# EAGLE design V9958 Video Card V2 (EAGLE 4.16)
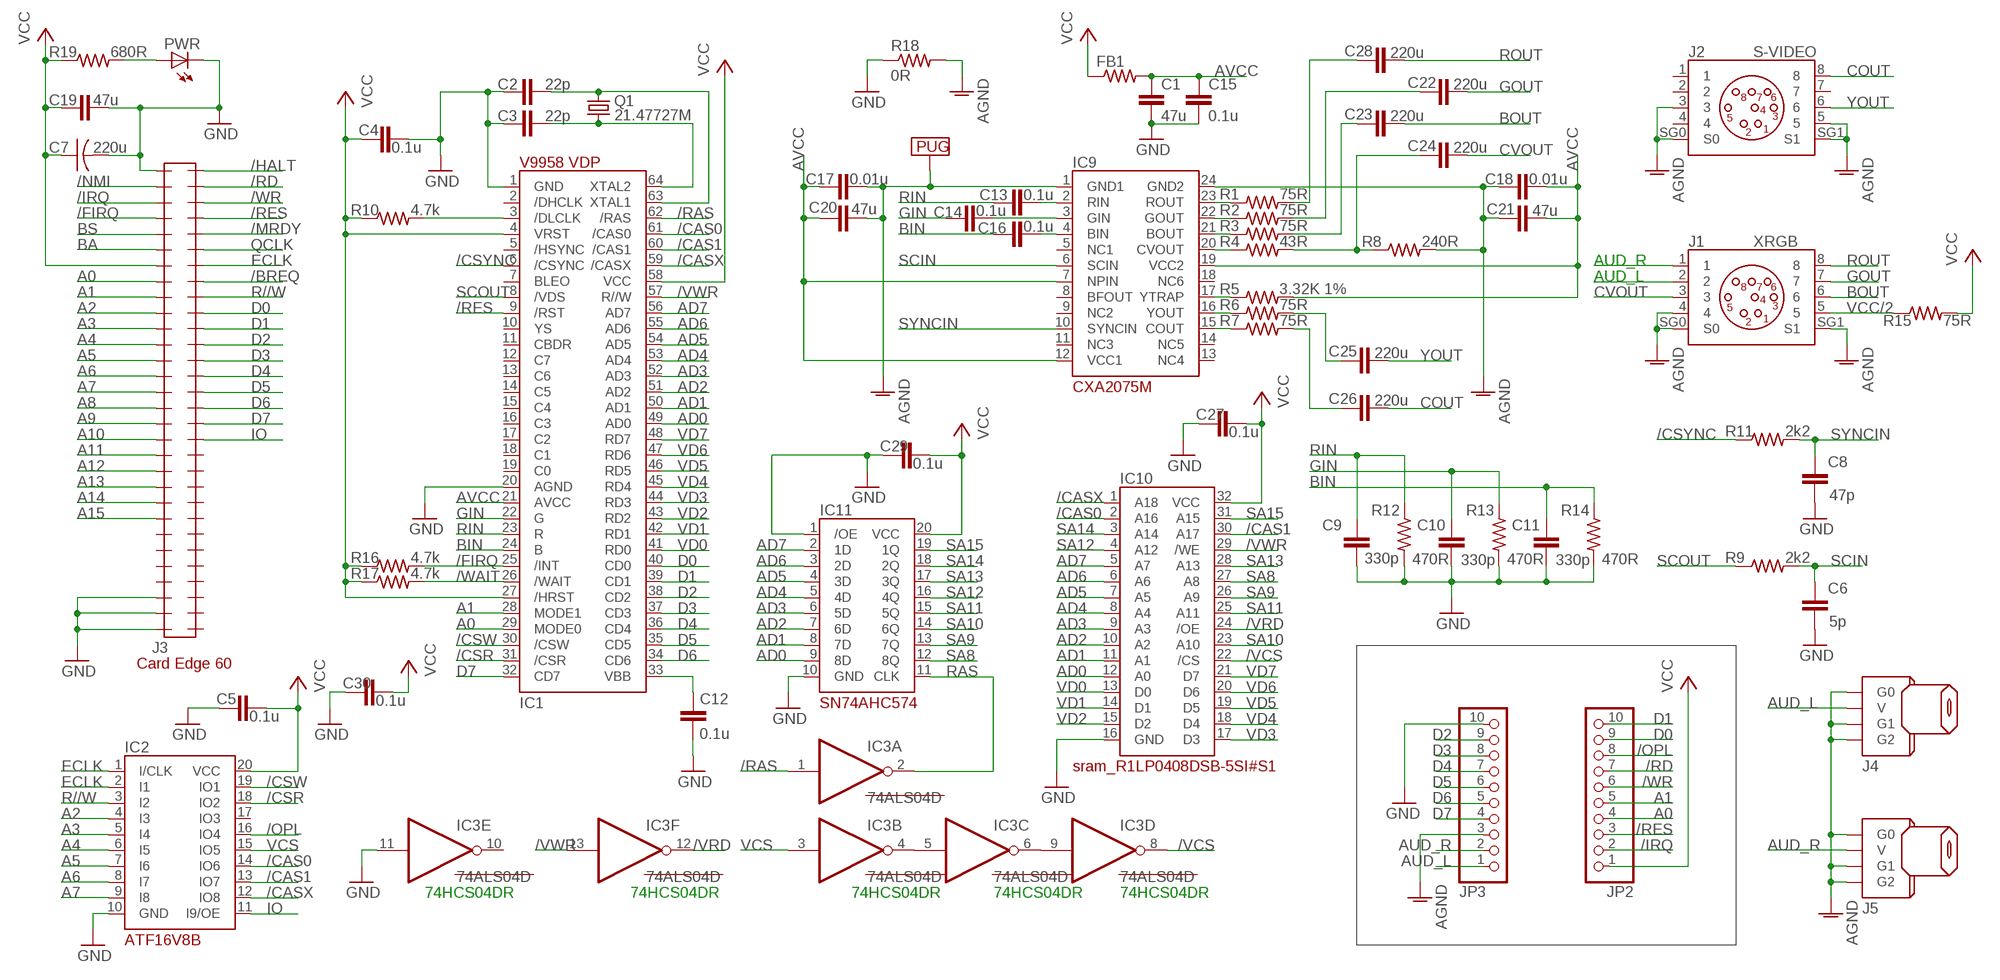
[diagram p0: schematic, sheet 1]

## Parts
C1  47u  C-EUC0805  [C0805]
C2  22p  C-EUC0603  [C0603]
C3  22p  C-EUC0603  [C0603]
C4  0.1u  C-EUC0603  [C0603]
C5  0.1u  C-EUC0603  [C0603]
C6  5p  C-EUC0603  [C0603]
C7  220u  C-US025-050X050  [C025-050X050]
C8  47p  C-EUC0603  [C0603]
C9  330p  C-EUC0603  [C0603]
C10  330p  C-EUC0603  [C0603]
C11  330p  C-EUC0603  [C0603]
C12  0.1u  C-EUC0603  [C0603]
C13  0.1u  C-EUC0603  [C0603]
C14  0.1u  C-EUC0603  [C0603]
C15  0.1u  C-EUC0603  [C0603]
C16  0.1u  C-EUC0603  [C0603]
C17  0.01u  C-EUC0603  [C0603]
C18  0.01u  C-EUC0603  [C0603]
C19  47u  C-EUC0805  [C0805]
C20  47u  C-EUC0805  [C0805]
C21  47u  C-EUC0805  [C0805]
C22  220u  C-EUC1206  [C1206]
C23  220u  C-EUC1206  [C1206]
C24  220u  C-EUC1206  [C1206]
C25  220u  C-EUC1206  [C1206]
C26  220u  C-EUC1206  [C1206]
C27  0.1u  C-EUC0603  [C0603]
C28  220u  C-EUC1206  [C1206]
C29  0.1u  C-EUC0603  [C0603]
C30  0.1u  C-EUC0603  [C0603]
FB1  R-US_R0603  [R0603]
IC1  YAMAHA_V9958  [V9958]
IC2  PLD_ATF16V8B  [DIL20]
IC3  74ALS04D  [SO14]
IC9  CXA2075M  [CXA2075M]
IC10  R1LP0408DSB-5SI#S1  [RENESAS_32-TSOP-II]
IC11  SN74AHC574PWRSO  [SOIC20]
J1  XRGB  MINI-DIN8  [MINI_DIN8]
J2  S-VIDEO  MINI-DIN8  [MINI_DIN8]
J3  CARDEDGE_2.54_60POSEDGE  [CARDEDGE_2.54_60POS]
J4  RCA_CONN_CUI_RCJ-014_CP-1403-ND  [RCA_JACK_CUI_RCJ-014_CP-1403-ND]
J5  RCA_CONN_CUI_RCJ-014_CP-1403-ND  [RCA_JACK_CUI_RCJ-014_CP-1403-ND]
JP2  PINHD-1X10  [1X10]
JP3  PINHD-1X10  [1X10]
PWR  LED3MM  [LED3MM]
Q1  21.47727M  CRYSTALHC49S  [HC49/S]
R1  75R  R-US_R0603  [R0603]
R2  75R  R-US_R0603  [R0603]
R3  75R  R-US_R0603  [R0603]
R4  43R  R-US_R0603  [R0603]
R5  3.32K 1%  R-US_R0603  [R0603]
R6  75R  R-US_R0603  [R0603]
R7  75R  R-US_R0603  [R0603]
R8  240R  R-US_R0603  [R0603]
R9  2k2  R-US_R0603  [R0603]
R10  4.7k  R-US_R0603  [R0603]
R11  2k2  R-US_R0603  [R0603]
R12  470R  R-US_R0603  [R0603]
R13  470R  R-US_R0603  [R0603]
R14  470R  R-US_R0603  [R0603]
R15  75R  R-US_R0603  [R0603]
R16  4.7k  R-US_R0603  [R0603]
R17  4.7k  R-US_R0603  [R0603]
R18  0R  R-US_R0603  [R0603]
R19  680R  R-US_R0603  [R0603]
U$1  PUG  [LARGE_PUG]

## Nets
/BREQ: J3.53
/CAS0: IC1.61(/CAS0) IC2.14(IO6) IC10.2(A16)
/CAS1: IC1.60(/CAS1) IC2.13(IO7) IC10.30(A17)
/CASX: IC1.59(/CASX) IC2.12(IO8) IC10.1(A18)
/CSR: IC1.31(/CSR) IC2.18(IO2)
/CSW: IC1.30(/CSW) IC2.19(IO1)
/CSYNC: IC1.6(/CSYNC) R11.1
/DLCLK: IC1.3(/DLCLK) R10.2
/FIRQ: IC1.25(/INT) J3.4 R16.2
/HALT: J3.60
/IRQ: J3.3 JP2.2
/MRDY: J3.56
/NMI: J3.2
/OPL: IC2.16(IO4) JP2.8
/RAS: IC1.62(/RAS) IC3.1(A:I)
/RD: J3.59 JP2.7
/RES: IC1.9(/RST) J3.57 JP2.3
/VCS: IC3.8(D:O) IC10.22(/CS)
/VRD: IC3.12(F:O) IC10.24(/OE)
/VWR: IC1.57(R//W) IC3.13(F:I) IC10.29(/WE)
/WAIT: IC1.26(/WAIT) R17.2
/WR: J3.58 JP2.6
A0: IC1.29(MODE0) J3.8 JP2.4
A1: IC1.28(MODE1) J3.9 JP2.5
A2: IC2.4(I3) J3.10
A3: IC2.5(I4) J3.11
A4: IC2.6(I5) J3.12
A5: IC2.7(I6) J3.13
A6: IC2.8(I7) J3.14
A7: IC2.9(I8) J3.15
A8: J3.16
A9: J3.17
A10: J3.18
A11: J3.19
A12: J3.20
A13: J3.21
A14: J3.22
A15: J3.23
AD0: IC1.49(AD0) IC10.12(A0) IC11.9(8D)
AD1: IC1.50(AD1) IC10.11(A1) IC11.8(7D)
AD2: IC1.51(AD2) IC10.10(A2) IC11.7(6D)
AD3: IC1.52(AD3) IC10.9(A3) IC11.6(5D)
AD4: IC1.53(AD4) IC10.8(A4) IC11.5(4D)
AD5: IC1.54(AD5) IC10.7(A5) IC11.4(3D)
AD6: IC1.55(AD6) IC10.6(A6) IC11.3(2D)
AD7: IC1.56(AD7) IC10.5(A7) IC11.2(1D)
AGND [agnd]: C17.2 C18.1 C20.2 C21.1 IC9.1(GND1) IC9.24(GND2) J1.4 J1.SG0(S0) J1.SG1(S1) J2.3 J2.5 J2.SG0(S0) J2.SG1(S1) J4.G0 J4.G1 J4.G2 J5.G0 J5.G1 J5.G2 JP3.3 R8.2 R18.2 U$1.P$1
AUD_L: J1.2 J4.V JP3.1
AUD_R: J1.1 J5.V JP3.2
AVCC [supply]: C1.1 C15.1 C17.1 C18.2 C20.1 C21.2 FB1.2 IC1.21(AVCC) IC9.7(NPIN) IC9.12(VCC1) IC9.19(VCC2) R5.2
BA: J3.6
BIN: C11.1 C16.1 IC1.24(B) R14.1
BOUT: C23.2 J1.6
BS: J3.5
COUT: C26.2 J2.8
CVOUT: C24.2 J1.3
D0: IC1.40(CD0) J3.51 JP2.9
D1: IC1.39(CD1) J3.50 JP2.10
D2: IC1.38(CD2) J3.49 JP3.9
D3: IC1.37(CD3) J3.48 JP3.8
D4: IC1.36(CD4) J3.47 JP3.7
D5: IC1.35(CD5) J3.46 JP3.6
D6: IC1.34(CD6) J3.45 JP3.5
D7: IC1.32(CD7) J3.44 JP3.4
ECLK: IC2.1(I/CLK) IC2.2(I1) J3.54
GIN: C10.1 C14.1 IC1.22(G) R13.1
GND: C1.2 C2.1 C3.1 C4.2 C5.1 C6.2 C7.2 C8.2 C9.2 C10.2 C11.2 C12.2 C15.2 C19.2 C27.1 C29.1 C30.1 IC1.1(GND) IC1.20(AGND) IC2.10(GND) IC3.11(E:I) IC10.16(GND) IC11.1(/OE) IC11.10(GND) J3.1 J3.28 J3.29 J3.30 JP3.10 PWR.K(C) R12.2 R13.2 R14.2 R18.1
GOUT: C22.2 J1.7
IO: IC2.11(I9/OE) J3.43
N$1: C2.2 IC1.63(XTAL1) Q1.2
N$2: C3.2 IC1.64(XTAL2) Q1.1
N$4: C13.2 IC9.2(RIN)
N$5: C14.2 IC9.3(GIN)
N$6: C16.2 IC9.4(BIN)
N$7: C26.1 R7.2
N$8: IC9.17(YTRAP) R5.1
N$9: IC9.23(ROUT) R1.1
N$10: IC9.22(GOUT) R2.1
N$11: IC9.21(BOUT) R3.1
N$12: IC9.20(CVOUT) R4.1
N$13: IC9.16(YOUT) R6.1
N$14: IC9.15(COUT) R7.1
N$15: C24.1 R4.2 R8.1
N$16: C25.1 R6.2
N$17: C23.1 R3.2
N$18: C22.1 R2.2
N$19: C28.1 R1.2
N$20: C12.1 IC1.33(VBB)
N$21: IC3.4(B:O) IC3.5(C:I)
N$22: IC3.6(C:O) IC3.9(D:I)
N$23: PWR.A R19.2
QCLK: J3.55
R//W: IC2.3(I2) J3.52
RAS: IC3.2(A:O) IC11.11(CLK)
RIN: C9.1 C13.1 IC1.23(R) R12.1
ROUT: C28.2 J1.8
SA8: IC10.27(A8) IC11.12(8Q)
SA9: IC10.26(A9) IC11.13(7Q)
SA10: IC10.23(A10) IC11.14(6Q)
SA11: IC10.25(A11) IC11.15(5Q)
SA12: IC10.4(A12) IC11.16(4Q)
SA13: IC10.28(A13) IC11.17(3Q)
SA14: IC10.3(A14) IC11.18(2Q)
SA15: IC10.31(A15) IC11.19(1Q)
SCIN: C6.1 IC9.6(SCIN) R9.2
SCOUT: IC1.8(/VDS) R9.1
SYNCIN: C8.1 IC9.10(SYNCIN) R11.2
VCC [supply]: C4.1 C5.2 C7.1 C19.1 C27.2 C29.2 C30.2 FB1.1 IC1.4(VRST) IC1.27(/HRST) IC1.58(VCC) IC2.20(VCC) IC10.32(VCC) IC11.20(VCC) J3.7 JP2.1 R10.1 R15.2 R16.1 R17.1 R19.1
VCC/2: J1.5 R15.1
VCS: IC2.15(IO5) IC3.3(B:I)
VD0: IC1.41(RD0) IC10.13(D0)
VD1: IC1.42(RD1) IC10.14(D1)
VD2: IC1.43(RD2) IC10.15(D2)
VD3: IC1.44(RD3) IC10.17(D3)
VD4: IC1.45(RD4) IC10.18(D4)
VD5: IC1.46(RD5) IC10.19(D5)
VD6: IC1.47(RD6) IC10.20(D6)
VD7: IC1.48(RD7) IC10.21(D7)
YOUT: C25.2 J2.6
Unconnected: IC1.2(/DHCLK) IC1.5(/HSYNC) IC1.7(BLEO) IC1.10(YS) IC1.11(CBDR) IC1.12(C7) IC1.13(C6) IC1.14(C5) IC1.15(C4) IC1.16(C3) IC1.17(C2) IC1.18(C1) IC1.19(C0) IC2.17(IO3) IC3.10(E:O) IC9.5(NC1) IC9.8(BFOUT) IC9.9(NC2) IC9.11(NC3) IC9.13(NC4) IC9.14(NC5) IC9.18(NC6) J2.1 J2.2 J2.4 J2.7 J3.24 J3.25 J3.26 J3.27 J3.31 J3.32 J3.33 J3.34 J3.35 J3.36 J3.37 J3.38 J3.39 J3.40 J3.41 J3.42

## Notes on the sheet
- AUD_R
- AUD_L
- 74HCS04DR | 74HCS04DR | 74HCS04DR | 74HCS04DR | 74HCS04DR

## Power pins joined to a net without a drawn wire
GND: IC3.7(P:GND)
VCC: IC3.14(P:VCC)

## Library data of the parts
C1-C6 C8-C30 = rcl:C-EU: CAPACITOR, European symbol
C7 = rcl:C-US: CAPACITOR, American symbol
FB1 R1-R19 = rcl:R-US_: RESISTOR, American symbol
IC1 = 07-Retrocomputing:YAMAHA_V9958
IC2 = 07-Retrocomputing:PLD_ATF16V8B
IC3 = 74xx-us:74*04: Hex INVERTER
IC9 = 07-Retrocomputing:CXA2075M
IC10 = 07-Retrocomputing:R1LP0408DSB-5SI#S1
IC11 = 07-Retrocomputing:SN74AHC574PWR
J1 J2 = 07-Retrocomputing:MINI-DIN8
J3 = 07-Retrocomputing:CARDEDGE_2.54_60POS
J4 J5 = 07-Retrocomputing:RCA_CONN_CUI_RCJ-014_CP-1403-ND
JP2 JP3 = pinhead:PINHD-1X10: PIN HEADER
PWR = led:LED: LED OSRAM: - CHIPLED LG R971, LG N971, LY N971, LG Q971, LY Q971, LO R971, LY R971 LH N974, LH R974 LS Q976, LO Q976, LY Q976 LO Q996 - Hyper CHIPLED LW Q18S LB Q993, LB Q99A, LB R99A - SideLED LS A670, LO A670, LY A670, LG A670, LP A670 LB A673, LV A673, LT A673, LW A673 LH A674 LY A675 LS A676, LA A676, LO A676, LY A676, LW A676 LS A679, LY A679, LG A679 - Hyper Micro SIDELED® LS Y876, LA Y876, LO Y876, LY Y876 LT Y87S - SmartLED LW L88C, LW L88S LB L89C, LB L89S, LG L890 LS L89K, LO L89K, LY L89K LS L896, LA L896, LO L896, LY L896 - TOPLED LS T670, LO T670, LY T670, LG T670, LP T670 LSG T670, LSP T670, LSY T670, LOP T670, LYG T670 LG T671, LOG T671, LSG T671 LB T673, LV T673, LT T673, LW T673 LH T674 LS T676, LA T676, LO T676, LY T676, LB T676, LH T676, LSB T676, LW T676 LB T67C, LV T67C, LT T67C, LS T67K, LO T67K, LY T67K, LW E67C LS E67B, LA E67B, LO E67B, LY E67B, LB E67C, LV E67C, LT E67C LW T67C LS T679, LY T679, LG T679 LS T770, LO T770, LY T770, LG T770, LP T770 LB T773, LV T773, LT T773, LW T773 LH T774 LS E675, LA E675, LY E675, LS T675 LS T776, LA T776, LO T776, LY T776, LB T776 LHGB T686 LT T68C, LB T68C - Hyper Mini TOPLED® LB M676 - Mini TOPLED Santana® LG M470 LS M47K, LO M47K, LY M47K Source: http://www.osram.convergy.de - LUMILED® LXK2-PW12-R00, LXK2-PW12-S00, LXK2-PW14-U00, LXK2-PW14-V00 LXK2-PM12-R00, LXK2-PM12-S00, LXK2-PM14-U00 LXK2-PE12-Q00, LXK2-PE12-R00, LXK2-PE12-S00, LXK2-PE14-T00, LXK2-PE14-U00 LXK2-PB12-K00, LXK2-PB12-L00, LXK2-PB12-M00, LXK2-PB14-N00, LXK2-PB14-P00, LXK2-PB14-Q00 LXK2-PR12-L00, LXK2-PR12-M00, LXK2-PR14-Q00, LXK2-PR14-R00 LXK2-PD12-Q00, LXK2-PD12-R00, LXK2-PD12-S00 LXK2-PH12-R00, LXK2-PH12-S00 LXK2-PL12-P00, LXK2-PL12-Q00, LXK2-PL12-R00 Source: www.luxeon.com
Q1 = crystal:CRYSTAL: CRYSTAL
U$1 = 07-Retrocomputing:PUG

## Net classes
0 default: width 0.203 mm, drill 0.203 mm, clearance 0.254 mm
1 supply: width 0.61 mm, drill 0.203 mm, clearance 0.305 mm
2 agnd: width 0.406 mm, drill 0.203 mm, clearance 0.305 mm

## Board
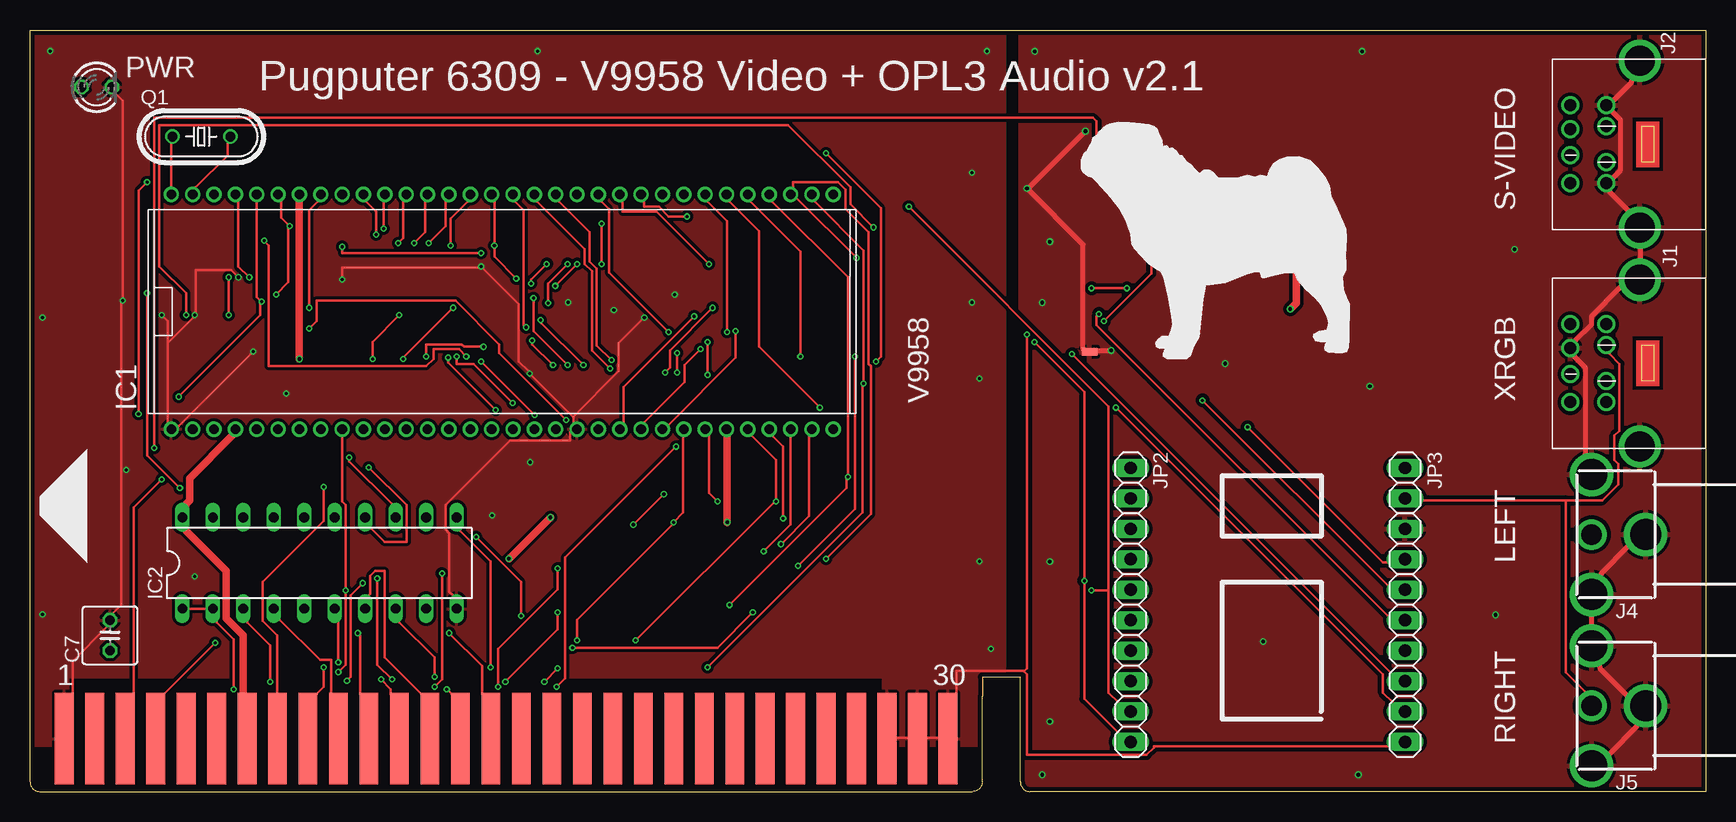
[diagram p1: board, top side]
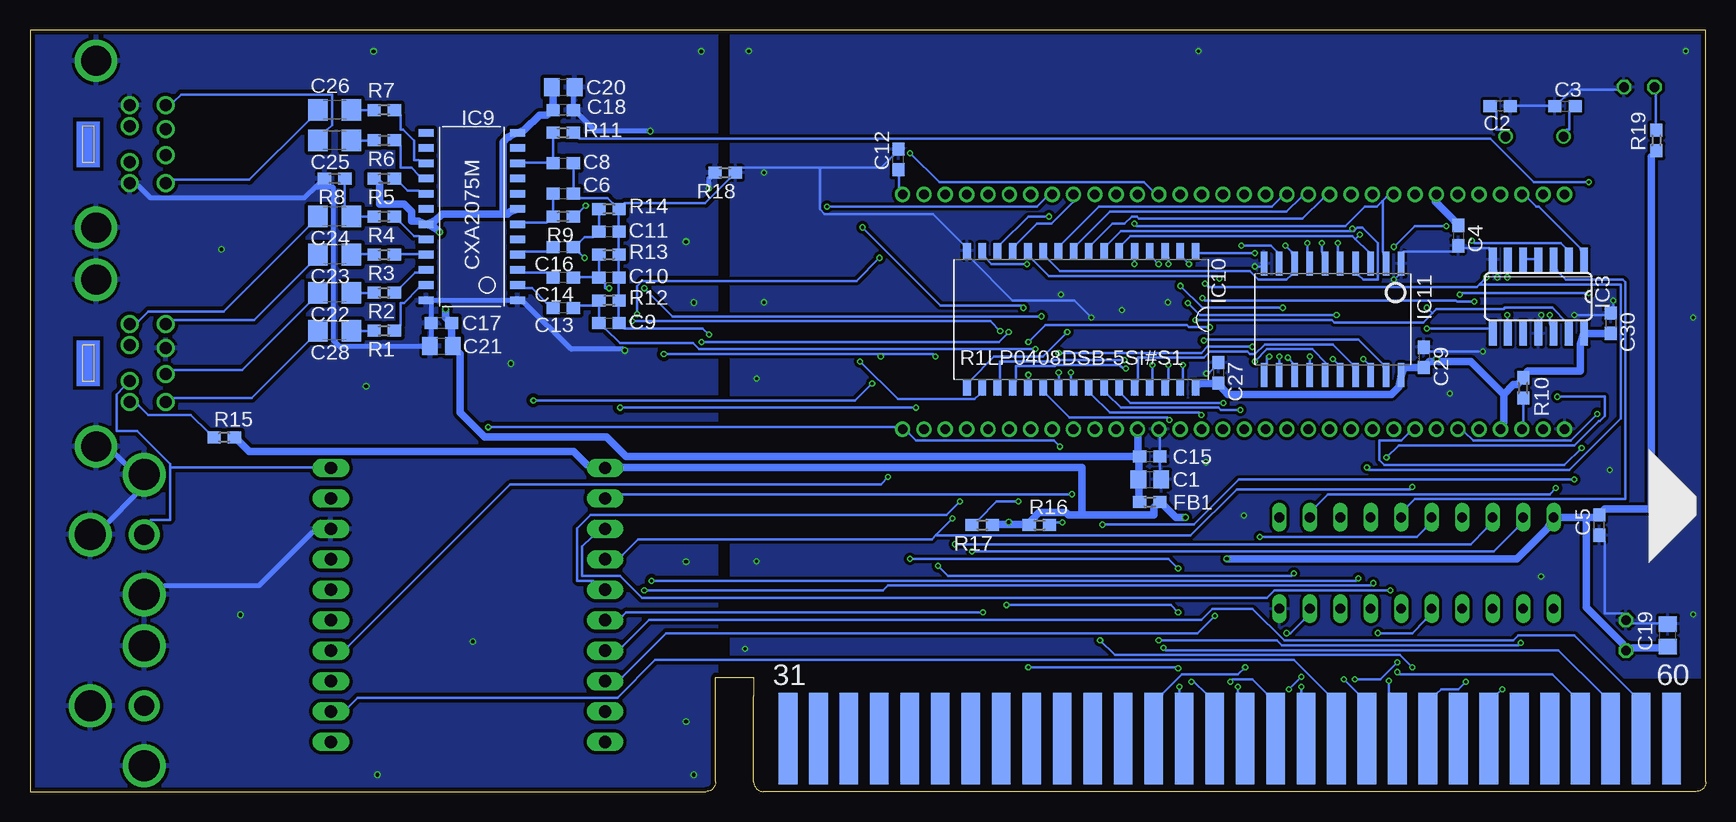
[diagram p2: board, bottom side, seen from below]

Size 139.7 x 63.5 mm. Coordinates in mm from the lower left corner, seen from the top.
Outline: 0,7.94 0,63.5 139.7,63.5 139.7,0 83.34,0 arc-90 82.55,0.79 82.55,9.53 79.38,9.53 79.38,7.94
Copper layers (1*16): Top 0.0356mm / dielectric 1.6mm / Bottom 0.0356mm
Design rules "oshpark-2layer": minimum track width 6mil, minimum drill 10mil, track to track 6mil, track to pad 6mil, pad to pad 6mil, via to via 6mil, smd to smd 6mil, copper to edge 15mil, drill to drill 6mil, minimum pad ring 5mil, minimum via ring 5mil, stop-mask expansion 2.5mil, vias tented up to drill 0mil, thermal gap 10mil

### Footprints (pad centres in the part's own frame; a part is rotated, then mirrored left to right if it is on the bottom)
C0805 = smd 1.3 x 1.5: 1 -0.95,0; 2 0.95,0
C0603 = smd 1.1 x 1: 1 -0.85,0; 2 0.85,0
C025-050X050 = drill 0.813 octagon: 1 -1.27,0; 2 1.27,0
C1206 = smd 1.6 x 1.8: 1 -1.4,0; 2 1.4,0
R0603 = smd 1.1 x 1: 1 -0.85,0; 2 0.85,0
V9958 = drill 0.8 pad 1.27 round: 1 -27.59,-9.79; 2 -25.81,-9.79; 3 -24.03,-9.79; 4 -22.25,-9.79; 5 -20.47,-9.79; 6 -18.69,-9.79; 7 -16.91,-9.79; 8 -15.13,-9.79; 9 -13.35,-9.79; 10 -11.57,-9.79; 11 -9.79,-9.79; 12 -8.01,-9.79; 13 -6.23,-9.79; 14 -4.45,-9.79; 15 -2.67,-9.79; 16 -0.89,-9.79; 17 0.89,-9.79; 18 2.67,-9.79; 19 4.45,-9.79; 20 6.23,-9.79; 21 8.01,-9.79; 22 9.79,-9.79; 23 11.57,-9.79; 24 13.35,-9.79; 25 15.13,-9.79; 26 16.91,-9.79; 27 18.69,-9.79; 28 20.47,-9.79; 29 22.25,-9.79; 30 24.03,-9.79; 31 25.81,-9.79; 32 27.59,-9.79; 33 27.59,9.79; 34 25.81,9.79; 35 24.03,9.79; 36 22.25,9.79; 37 20.47,9.79; 38 18.69,9.79; 39 16.91,9.79; 40 15.13,9.79; 41 13.35,9.79; 42 11.57,9.79; 43 9.79,9.79; 44 8.01,9.79; 45 6.23,9.79; 46 4.45,9.79; 47 2.67,9.79; 48 0.89,9.79; 49 -0.89,9.79; 50 -2.67,9.79; 51 -4.45,9.79; 52 -6.23,9.79; 53 -8.01,9.79; 54 -9.79,9.79; 55 -11.57,9.79; 56 -13.35,9.79; 57 -15.13,9.79; 58 -16.91,9.79; 59 -18.69,9.79; 60 -20.47,9.79; 61 -22.25,9.79; 62 -24.03,9.79; 63 -25.81,9.79; 64 -27.59,9.79
DIL20 = drill 0.813 long: 1 -11.43,-3.81; 2 -8.89,-3.81; 3 -6.35,-3.81; 4 -3.81,-3.81; 5 -1.27,-3.81; 6 1.27,-3.81; 7 3.81,-3.81; 8 6.35,-3.81; 9 8.89,-3.81; 10 11.43,-3.81; 11 11.43,3.81; 12 8.89,3.81; 13 6.35,3.81; 14 3.81,3.81; 15 1.27,3.81; 16 -1.27,3.81; 17 -3.81,3.81; 18 -6.35,3.81; 19 -8.89,3.81; 20 -11.43,3.81
SO14 = smd 0.66 x 2.032: 1 -3.81,-3.073; 2 -2.54,-3.073; 3 -1.27,-3.073; 4 0,-3.073; 5 1.27,-3.073; 6 2.54,-3.073; 7 3.81,-3.073; 8 3.81,3.073; 9 2.54,3.073; 10 1.27,3.073; 11 0,3.073; 12 -1.27,3.073; 13 -2.54,3.073; 14 -3.81,3.073
CXA2075M = smd 1.27 x 0.635: 1 -3.81,6.985; 2 -3.81,5.715; 3 -3.81,4.445; 4 -3.81,3.175; 5 -3.81,1.905; 6 -3.81,0.635; 7 -3.81,-0.635; 8 -3.81,-1.905; 9 -3.81,-3.175; 10 -3.81,-4.445; 11 -3.81,-5.715; 12 -3.81,-6.985; 13 3.81,-6.985; 14 3.81,-5.715; 15 3.81,-4.445; 16 3.81,-3.175; 17 3.81,-1.905; 18 3.81,-0.635; 19 3.81,0.635; 20 3.81,1.905; 21 3.81,3.175; 22 3.81,4.445; 23 3.81,5.715; 24 3.81,6.985
RENESAS_32-TSOP-II = smd 1.27 x 0.635: 1 -5.715,9.525; 2 -5.715,8.255; 3 -5.715,6.985; 4 -5.715,5.715; 5 -5.715,4.445; 6 -5.715,3.175; 7 -5.715,1.905; 8 -5.715,0.635; 9 -5.715,-0.635; 10 -5.715,-1.905; 11 -5.715,-3.175; 12 -5.715,-4.445; 13 -5.715,-5.715; 14 -5.715,-6.985; 15 -5.715,-8.255; 16 -5.715,-9.525; 17 5.715,-9.525; 18 5.715,-8.255; 19 5.715,-6.985; 20 5.715,-5.715; 21 5.715,-4.445; 22 5.715,-3.175; 23 5.715,-1.905; 24 5.715,-0.635; 25 5.715,0.635; 26 5.715,1.905; 27 5.715,3.175; 28 5.715,4.445; 29 5.715,5.715; 30 5.715,6.985; 31 5.715,8.255; 32 5.715,9.525
SOIC20 = smd 2 x 0.55: 1 -4.645,5.715; 2 -4.645,4.445; 3 -4.645,3.175; 4 -4.645,1.905; 5 -4.645,0.635; 6 -4.645,-0.635; 7 -4.645,-1.905; 8 -4.645,-3.175; 9 -4.645,-4.445; 10 -4.645,-5.715; 11 4.645,-5.715; 12 4.645,-4.445; 13 4.645,-3.175; 14 4.645,-1.905; 15 4.645,-0.635; 16 4.645,0.635; 17 4.645,1.905; 18 4.645,3.175; 19 4.645,4.445; 20 4.645,5.715
MINI_DIN8 = drill 1 round: 1 1.5,8.3; 2 -1.5,8.3; 3 3.25,8.3; 4 1.25,11.3; 5 -3.25,8.3; 6 3.25,11.3; 7 -0.9,11.3; 8 -3.25,11.3 | drill 2.5 round: SG0 -6.95,5.5; SG1 6.95,5.5
CARDEDGE_2.54_60POS = smd 1.556 x 7.62: 1 -36.83,4.41; 2 -34.29,4.41; 3 -31.75,4.41; 4 -29.21,4.41; 5 -26.67,4.41; 6 -24.13,4.41; 7 -21.59,4.41; 8 -19.05,4.41; 9 -16.51,4.41; 10 -13.97,4.41; 11 -11.43,4.41; 12 -8.89,4.41; 13 -6.35,4.41; 14 -3.81,4.41; 15 -1.27,4.41; 16 1.27,4.41; 17 3.81,4.41; 18 6.35,4.41; 19 8.89,4.41; 20 11.43,4.41; 21 13.97,4.41; 22 16.51,4.41; 23 19.05,4.41; 24 21.59,4.41; 25 24.13,4.41; 26 26.67,4.41; 27 29.21,4.41; 28 31.75,4.41; 29 34.29,4.41; 30 36.83,4.41 | smd 1.556 x 7.62 bottom: 31 36.83,4.41; 32 34.29,4.41; 33 31.75,4.41; 34 29.21,4.41; 35 26.67,4.41; 36 24.13,4.41; 37 21.59,4.41; 38 19.05,4.41; 39 16.51,4.41; 40 13.97,4.41; 41 11.43,4.41; 42 8.89,4.41; 43 6.35,4.41; 44 3.81,4.41; 45 1.27,4.41; 46 -1.27,4.41; 47 -3.81,4.41; 48 -6.35,4.41; 49 -8.89,4.41; 50 -11.43,4.41; 51 -13.97,4.41; 52 -16.51,4.41; 53 -19.05,4.41; 54 -21.59,4.41; 55 -24.13,4.41; 56 -26.67,4.41; 57 -29.21,4.41; 58 -31.75,4.41; 59 -34.29,4.41; 60 -36.83,4.41
RCA_JACK_CUI_RCJ-014_CP-1403-ND = drill 2.6 round: G0 -5,0; G1 0,4.5; G2 5,0 | drill 1.7 round: V 0,0
1X10 = drill 1.016 long: 1 -11.43,0; 2 -8.89,0; 3 -6.35,0; 4 -3.81,0; 5 -1.27,0; 6 1.27,0; 7 3.81,0; 8 6.35,0; 9 8.89,0; 10 11.43,0
LED3MM = drill 0.813 octagon: A -1.27,0; K 1.27,0
HC49/S = drill 0.813 round: 1 -2.413,0; 2 2.413,0
LARGE_PUG = smd 1.27 x 0.635: P$1 2.286,3.962

### Placement (x,y rotation side)
C1  46.35,26.04 0 bottom
C2  17.14,57.15 180 bottom
C3  11.75,57.15 0 bottom
C4  20.64,46.36 270 bottom
C5  8.89,22.23 90 bottom
C6  95.25,49.85 0 bottom
C7  6.67,13.02 90 top
C8  95.25,52.39 0 bottom
C9  91.44,39.05 0 bottom
C10  91.44,42.86 0 bottom
C11  91.44,46.67 0 bottom
C12  67.31,52.7 90 bottom
C13  95.25,40.32 180 bottom
C14  95.25,42.86 180 bottom
C15  46.35,27.94 0 bottom
C16  95.25,45.4 180 bottom
C17  105.41,39.05 180 bottom
C18  95.25,56.83 180 bottom
C19  3.17,13.02 90 bottom
C20  95.25,58.74 0 bottom
C21  105.41,37.15 0 bottom
C22  114.3,41.59 180 bottom
C23  114.3,44.77 180 bottom
C24  114.3,47.94 180 bottom
C25  114.3,54.29 180 bottom
C26  114.3,56.83 180 bottom
C27  40.64,34.92 270 bottom
C28  114.3,38.42 180 bottom
C29  23.5,36.2 270 bottom
C30  7.94,39.05 270 bottom
FB1  46.35,24.13 180 bottom
IC1  39.37,40.01 0 top
IC2  24.13,19.05 0 top
IC3  13.97,41.27 180 bottom
IC9  102.87,47.94 180 bottom
IC10  52.07,39.37 270 bottom
IC11  31.11,39.37 270 bottom
J1  139.7,35.72 90 top
J2  139.7,53.98 90 top
J3  39.69,0 0 top
J4  130.18,21.43 270 top
J5  130.18,7.14 270 top
JP2  91.76,15.56 270 top
JP3  114.62,15.56 270 top
PWR  5.56,58.74 0 top
Q1  14.29,54.61 0 top
R1  110.17,38.42 180 bottom
R2  110.17,41.59 180 bottom
R3  110.17,44.77 180 bottom
R4  110.17,47.94 180 bottom
R5  110.17,51.12 180 bottom
R6  110.17,54.29 180 bottom
R7  110.17,56.83 180 bottom
R8  114.3,51.12 180 bottom
R9  95.25,47.94 180 bottom
R10  15.24,33.66 270 bottom
R11  95.25,54.93 180 bottom
R12  91.44,40.96 0 bottom
R13  91.44,44.77 0 bottom
R14  91.44,48.58 0 bottom
R15  123.51,29.53 0 bottom
R16  55.56,22.23 0 bottom
R17  60.33,22.23 180 bottom
R18  81.76,51.59 180 bottom
R19  4.13,54.29 90 bottom
U$1  86.04,32.7 0 top

### Tracks (layer width: path | path; a pad name or v marks a point on that pad's centre or on a via)
/CAS0  (via drill 0.25)
  Top 0.203: v43.08,43.99 41.76,42.67 v41.76,42.37 | v18.29,42.88 17.37,43.79 17.37,49.17 IC1.61 | v28.25,27.03 31.39,23.88 31.39,20.83 29.57,20.83 28.45,21.95 IC2.14
  Bottom 0.203: v43.08,43.99 43.59,44.5 IC10.2 | v41.76,42.37 41.45,42.06 19.1,42.06 18.85,42.32 | 18.85,42.32 v18.29,42.88 | v28.25,27.03 28.04,26.82 11.38,26.82 7.11,31.09 7.11,42.27 18.8,42.27 18.85,42.32
/CAS1  (via drill 0.25)
  Top 0.203: v44.81,35.56 41.96,38.41 v41.96,41.15 | IC1.60 18.9,49.17 18.9,41.25 v19.3,40.84 19.2,40.64 19.2,39.73 v12.39,32.92 | v26.62,27.84 26.62,27.53 30.18,23.98 IC2.13
  Bottom 0.203: v44.81,35.56 44.81,34.24 IC10.30 | v41.96,41.15 41.76,40.95 20.83,40.95 20.73,40.84 v19.3,40.84 | v26.62,27.84 25.6,28.85 10.97,28.85 8.94,30.89 8.84,30.89 8.43,31.29 8.43,32.92 v12.39,32.92
/CASX  (via drill 0.25)
  Top 0.203: v37.59,44.91 26.01,44.91 v26.01,45.41 | IC1.59 20.93,49.17 20.93,47.85 v21.64,47.14 21.54,46.94 21.54,42.47 v20.52,41.45 | v12.5,25.3 9.75,28.04 v9.75,41.55
  Bottom 0.203: v37.59,44.91 42.27,44.91 IC10.1 | v26.01,45.41 24.28,47.14 v21.64,47.14 | v12.5,25.3 13.01,24.79 31.5,24.79 32.51,23.77 IC2.12 | v9.75,41.55 20.42,41.55 v20.52,41.45
/CSR  (via drill 0.25)
  Top 0.203: v62.59,20.62 64.92,22.96 64.92,29.67 IC1.31
  Bottom 0.203: v62.59,20.62 19.61,20.62 18.29,21.95 IC2.18
/CSW  (via drill 0.25)
  Top 0.203: v61.16,20.02 63.4,22.25 63.4,29.67 IC1.30
  Bottom 0.203: v61.16,20.02 17.68,20.02 15.75,21.95 IC2.19
/CSYNC  (via drill 0.25)
  Top 0.203: v9.75,50.8 9.04,50.09 v9.04,31.5
  Bottom 0.203: v9.75,50.8 14.33,50.8 17.98,54.46 93.88,54.46 R11.1 | v9.04,31.5 11.28,29.26 19.41,29.26 20.12,29.97 IC1.6
/DLCLK
  Bottom 0.203: R10.2 15.24,30.79 IC1.3
/FIRQ  (via drill 0.25)
  Top 0.203: IC1.25 54.46,29.67 54.46,23.27 v53.65,22.45 53.54,22.25 45.62,14.33 v45.62,12.6 | v15.44,12.39 11.18,8.13 J3.4
  Bottom 0.203: v53.65,22.45 54.25,22.45 R16.2 | v45.62,12.6 35.76,12.6 35.36,12.19 15.65,12.19 v15.44,12.39
/IRQ  (via drill 0.25)
  Top 0.203: v50.29,22.25 v52.83,24.79 | v10.97,26.01 8.64,23.67 8.64,8.13 J3.3
  Bottom 0.203: v52.83,24.79 90.32,24.79 JP2.2 | v50.29,22.25 42.67,22.25 38.91,26.01 v10.97,26.01
/OPL  (via drill 0.25)
  Top 0.203: v37.19,21.23 40.95,17.48 v40.95,14.63
  Bottom 0.203: v37.19,21.23 24.08,21.23 23.37,21.95 IC2.16 | v40.95,14.63 42.37,13.21 86.67,13.21 90.32,9.55 JP2.8
/RAS
  Bottom 0.203: IC3.1 10.46,45.31 13.92,48.77 14.12,48.77 14.83,49.48 IC1.62
/RD
  Bottom 0.203: JP2.7 90.32,12.09 88.09,14.33 42.06,14.33 41.15,15.24 37.8,15.24 35.15,12.6 16.05,12.6 15.65,13.01 10.97,13.01 6.1,8.13 J3.59
/RES  (via drill 0.25)
  Top 0.203: v25.7,9.96 26.31,10.57 v26.31,16.76 26.31,23.88 26.01,24.18 26.01,29.67 IC1.9
  Bottom 0.203: v25.7,9.96 25.5,9.75 12.8,9.75 11.18,8.13 J3.57 | v26.31,16.76 35.97,16.76 36.58,16.15 88.7,16.15 90.53,17.98 93.67,17.98 93.67,20.42 92.86,21.23 JP2.3
/VCS  (via drill 0.25)
  Top 0.203: v44.7,30.99 39.12,36.58 39.12,37.29 35.46,40.95 23.88,40.95 23.88,39.22 v23.27,38.61
  Bottom 0.203: v44.7,30.99 44.91,31.19 53.03,31.19 54.97,33.12 IC10.22 | v23.27,38.61 18.09,38.61 IC3.8
/VRD  (via drill 0.25)
  Top 0.203: v52.93,34.95 53.34,35.36 53.34,36.78 v56.9,40.34 | v70.31,47.04 68.38,48.97 68.38,50.39 63.2,55.58 10.77,55.58 10.77,43.79 13.01,41.55 v13.01,39.73
  Bottom 0.203: v52.93,34.95 52.93,34.24 IC10.24 | v56.9,40.34 57.1,40.54 63.8,40.54 v70.31,47.04 | v13.01,39.73 13.01,39.12 IC3.12
/VWR  (via drill 0.25)
  Top 0.203: v46.13,35.56 42.57,39.12 v42.57,39.32 | v23.27,40.34 23.27,48.46 23.98,49.17 IC1.57
  Bottom 0.203: v46.13,35.56 46.13,34.24 IC10.29 | v42.57,39.32 31.19,39.32 30.99,39.12 23.57,39.12 22.81,39.88 | 22.81,39.88 22.45,40.23 16.87,40.23 16.76,40.34 12.8,40.34 11.58,39.12 IC3.13 | 22.81,39.88 v23.27,40.34
/WAIT  (via drill 0.25)
  Top 0.203: v57.3,24.18 56.59,24.89 56.59,29.67 IC1.26
  Bottom 0.203: v57.3,24.18 59.13,24.18 60.66,22.66 R17.2
/WR  (via drill 0.25)
  Top 0.203: v60.25,14.94 57.3,11.99 v45.21,11.99
  Bottom 0.203: v60.25,14.94 90.02,14.94 90.32,14.63 JP2.6 | v45.21,11.99 45.01,11.79 12.29,11.79 8.64,8.13 J3.58
A0  (via drill 0.25)
  Top 0.203: v62.79,22.76 62.79,28.75 61.87,29.67 IC1.29 | v24.49,25.4 24.49,22.55 19.41,17.48 19.41,14.22 20.62,13.01 20.62,8.13 J3.8
  Bottom 0.203: 64.16,21.39 64.52,21.03 89,21.03 90.32,19.71 JP2.4 | 64.16,21.39 v62.79,22.76 | v24.49,25.4 24.69,25.2 39.12,25.2 42.98,21.34 64.11,21.34 64.16,21.39
A1  (via drill 0.25)
  Top 0.203: IC1.28 60.15,29.67 62.18,27.64 v62.18,24.18 61.98,24.08 v50.49,12.6 | v24.49,10.36 24.49,8.74 23.88,8.13 J3.9
  Bottom 0.203: v62.18,24.18 63.3,23.06 92.96,23.06 94.08,21.95 94.08,17.58 92.76,17.58 JP2.5 | v24.49,10.36 25.5,11.38 49.28,11.38 v50.49,12.6
A2
  Top 0.203: IC2.4 20.83,14.33 24.18,10.97 25.09,10.97 25.09,8.13 J3.10
A3  (via drill 0.25)
  Top 0.203: v27.33,13.21 27.53,13.01 27.53,8.13 J3.11
  Bottom 0.203: v27.33,13.21 24.49,13.21 23.37,14.33 IC2.5
A4  (via drill 0.25)
  Top 0.203: v25.7,10.77 25.7,14.12 IC2.6 | v29.26,9.35 30.07,8.53 30.07,8.13 J3.12
  Bottom 0.203: v25.7,10.77 27.13,9.35 v29.26,9.35
A5
  Top 0.203: IC2.7 28.25,16.36 28.35,16.46 28.35,17.98 28.75,18.39 29.57,18.39 29.57,11.18 32.61,8.13 J3.13
A6  (via drill 0.25)
  Top 0.203: v33.73,9.55 33.73,11.18 30.79,14.12 IC2.8 | v34.75,8.53 35.15,8.13 J3.14
  Bottom 0.203: v34.75,8.53 v33.73,9.55
A7  (via drill 0.25)
  Top 0.203: v34.95,13.21 37.69,10.46 37.69,8.13 J3.15
  Bottom 0.203: v34.95,13.21 34.65,13.21 33.53,14.33 IC2.9
AD0  (via drill 0.25)
  Top 0.203: v40.54,42.77 38.71,44.6 v38.71,45.52 38.71,49.17 IC1.49
  Bottom 0.203: v40.54,42.77 40.74,42.98 54.76,42.98 56.29,44.5 IC10.12 | v38.71,45.52 36.27,45.52 35.76,45.01 IC11.9
AD1  (via drill 0.25)
  Top 0.203: v35.05,45.52 35.05,47.75 36.47,49.17 IC1.50
  Bottom 0.203: IC10.11 54.97,44.5 53.85,43.38 38,43.38 37.29,42.67 34.95,42.67 34.54,43.08 IC11.8 34.54,45.01 v35.05,45.52
AD2  (via drill 0.25)
  Top 0.203: v33.22,45.72 34.65,47.14 34.65,49.17 IC1.51
  Bottom 0.203: IC10.10 53.75,45.62 50.6,48.77 36.17,48.77 35.46,49.48 IC1.51 | v33.22,45.72 33.22,45.01 IC11.7
AD3  (via drill 0.25)
  Top 0.203: v32,45.72 32.92,46.63 32.92,49.17 IC1.52
  Bottom 0.203: IC10.9 52.43,45.62 49.68,48.36 34.95,48.36 33.73,49.58 IC1.52 | v32,45.72 32,45.01 IC11.6
AD4  (via drill 0.25)
  Top 0.203: v30.68,45.72 31.09,46.13 31.09,49.17 IC1.53
  Bottom 0.203: IC10.8 51.21,45.62 49.48,47.35 48.46,47.35 47.85,47.95 47.45,47.95 47.24,47.75 33.63,47.75 31.9,49.48 IC1.53 | v30.68,45.72 30.68,45.01 IC11.5
AD5  (via drill 0.25)
  Top 0.203: v29.46,46.94 29.46,49.17 IC1.54
  Bottom 0.203: 29.31,46.79 29.06,47.04 28.65,47.04 27.33,45.72 27.33,42.67 28.55,42.67 28.96,43.08 IC11.4 | 29.31,46.79 29.36,46.74 48.77,46.74 49.89,45.62 IC10.7 | 29.31,46.79 v29.46,46.94
AD6  (via drill 0.25)
  Top 0.203: v28.85,46.43 28.85,48.36 28.04,49.17 IC1.55
  Bottom 0.203: 29.21,46.08 28.14,45.01 IC11.3 | 29.21,46.08 29.46,46.33 47.95,46.33 48.67,45.62 IC10.6 | 29.21,46.08 v28.85,46.43
AD7  (via drill 0.25)
  Top 0.203: v47.65,47.35 v47.65,43.99
  Bottom 0.203: v47.65,43.99 47.65,44.5 IC10.5 | v47.65,47.35 47.45,47.14 30.07,47.14 28.45,48.77 27.43,48.77 26.98,49.23 | 26.98,49.23 26.62,49.58 IC1.56 | IC11.2 26.92,45.01 26.92,49.17 26.98,49.23
AGND  (via drill 0.3)
  Top 0.406: J5.G2 131.67,3.15 133.91,5.38 J5.G1 133.1,8.03 130.86,10.26 130.86,10.36 J5.G0 130.15,13.92 130.15,14.63 J4.G2 130.96,18.19 133.2,20.42 J4.G1 | v87.99,55.07 83.31,50.39 v83.11,50.29 87.78,45.62 87.78,36.88 U$1.P$1 88.9,36.78 v90.12,36.78 | J2.SG1 133.5,59.23 133.5,59.13 131.98,57.61 J2.3 131.88,56.69 132.59,55.98 132.59,51.82 131.98,51.21 J2.5 131.67,49.99 133.2,48.46 J2.SG0 134.21,45.31 134.21,44.4 J1.SG1 132.49,41.96 130.15,39.62 130.15,38.91 128.83,37.59 J1.4 128.73,36.27 129.64,35.36 129.64,28.14 J4.G0
  Bottom 0.406: J1.SG0 132.49,28.04 131.78,27.33 J4.G0 130.96,24.69 133.2,22.45 J4.G1 | JP3.3 116.13,21.64 120.6,17.17 128.42,17.17 J4.G2 | C20.2 94.39,58.01 94.39,57.3 C18.1 93.88,56.39 92.56,55.07 v87.99,55.07 | v83.11,50.29 83.11,51.1 R18.2 | 115.82,50.49 116.84,49.48 129.64,49.48 130.66,50.49 J2.5 | 115.82,50.49 115.62,50.7 R8.2 | 115.82,50.49 115.72,50.39 114.4,50.39 114.4,37.59 113.89,37.08 106.98,37.08 C21.1 106.27,37.9 106.27,38.61 C17.2 106.27,39.52 106.27,40.74 IC9.24 106.07,40.95 99.67,40.95 IC9.1 98.45,40.74 94.59,36.88 90.22,36.88 v90.12,36.78
  other vias: 83.74,61.72 110.73,1.4 84.38,1.4 85.01,5.84 85.01,45.85 111.68,33.78 102.79,12.51 122.16,14.73 123.75,45.21 111.05,61.72 84.38,40.77 85.01,19.18 99.62,35.69
  pour Bottom: 139.7,63.5 82.55,63.5 82.55,0 139.7,0
  pour Top: 139.7,0 139.7,63.5 82.55,63.5 82.55,0
AUD_L
  Bottom 0.203: 128.02,27.03 128.02,22.66 129.64,22.66 J4.V | 128.02,27.03 128.02,27.33 130.76,30.07 132.49,30.07 132.49,33.12 131.88,33.73 J1.2 | 128.02,27.03 116.13,27.03 JP3.1
AUD_R
  Top 0.203: 128.02,24.28 116.13,24.28 JP3.2 | 128.02,24.28 131.06,24.28 132.38,25.6 132.38,27.33 132.08,27.64 132.08,29.67 132.49,30.07 132.49,35.66 131.67,36.47 J1.1 | 128.02,24.28 128.02,9.96 129.64,8.33 J5.V
AVCC  (via drill 0.3)
  Top 0.61: v105.05,40.23 105.56,40.74 v105.56,46.63
  Bottom 0.61: FB1.2 47.24,24.59 47.24,25.3 C1.1 47.24,26.72 47.24,27.53 C15.1 | IC1.21 47.35,29.67 47.35,28.35 C15.1 | C20.1 96.11,58.01 96.11,57.3 C18.2 96.62,56.39 97.23,56.39 98.45,55.17 IC9.12 99.67,54.66 99.77,54.56 99.87,54.56 100.28,54.15 100.28,48.16 | R5.2 110.54,50.7 110.54,48.97 108.51,48.97 107.9,48.36 107.9,47.55 107.29,47.55 IC9.19 | 100.28,48.16 105.36,48.16 105.97,47.55 106.07,47.55 IC9.19 | 100.28,48.16 99.87,48.16 99.67,48.36 IC9.7 | v105.05,40.23 105.05,39.52 C17.1 104.55,38.61 104.55,37.9 C21.2 103.83,36.47 103.83,31.6 101.8,29.57 91.64,29.57 90.02,27.94 C15.1 | v105.56,46.63 105.97,47.04 106.07,47.04 IC9.19
BIN  (via drill 0.25)
  Top 0.203: v58.83,38.41 58.83,36.17 53.24,30.58 IC1.24 | v89.51,39.22 93.47,43.18 v93.47,44.5
  Bottom 0.203: R14.1 92.25,48.16 92.25,47.14 C11.1 92.76,46.23 93.47,46.23 93.88,45.82 C16.1 93.88,44.91 v93.47,44.5 | v58.83,38.41 59.64,39.22 v89.51,39.22
BOUT
  Bottom 0.203: C23.2 116.43,43.89 121.01,39.32 127.71,39.32 J1.6
COUT
  Bottom 0.203: C26.2 116.43,55.98 121.41,51 127.71,51 J2.8
CVOUT
  Bottom 0.203: C24.2 116.43,47.14 123.55,40.03 129.84,40.03 130.66,39.22 J1.3
D0  (via drill 0.25)
  Top 0.203: v73.25,48.77 89.92,32.11 89.92,16.76 | 89.92,16.76 89.92,8.23 90.73,7.42 JP2.9 | v26.42,9.25 26.72,9.55 26.72,16.36 v27.74,17.37 | v88.49,16.76 89.92,16.76
  Bottom 0.203: v73.25,48.77 55.78,48.77 55.07,49.48 IC1.40 | v26.42,9.25 26.42,8.13 J3.51 | v27.74,17.37 27.94,17.17 68.17,17.17 68.58,16.76 v88.49,16.76
D1  (via drill 0.25)
  Top 0.203: v58.12,38.3 58.12,47.55 56.49,49.17 IC1.39 | v83.72,37.49 87.88,33.33 v87.88,17.58 87.88,7.72 90.73,4.88 JP2.10 | v30.18,9.35 28.96,10.57 v28.96,17.78
  Bottom 0.203: v58.12,38.3 58.93,37.49 v83.72,37.49 | v30.18,9.35 28.96,8.13 J3.50 | v28.96,17.78 29.16,17.58 v87.88,17.58
D2  (via drill 0.25)
  Top 0.203: v65.84,32 60.76,37.08 60.76,46.74 58.32,49.17 IC1.38 | v90.53,32 112.78,9.75 112.78,8.23 113.59,7.42 JP3.9
  Bottom 0.203: v90.53,32 v65.84,32 | J3.49 31.5,8.13 34.34,10.97 87.58,10.97 90.73,7.82 112.37,7.82 113.18,7.01 JP3.9
D3  (via drill 0.25)
  Top 0.203: v64.21,36.27 64.21,45.01 60.05,49.17 IC1.37 | v86.87,36.47 113.49,9.86 JP3.8 | v33.73,8.74 34.34,9.35 v34.34,18.19 | v64.01,18.8 68.78,23.57 v68.78,36.27
  Bottom 0.203: v64.21,36.27 64.41,36.47 68.78,36.47 | 68.78,36.47 v86.87,36.47 | v33.73,8.74 33.73,8.13 J3.48 | v34.34,18.19 34.54,17.98 63.2,17.98 v64.01,18.8 | v68.78,36.27 68.78,36.47
D4  (via drill 0.25)
  Top 0.203: IC1.36 61.87,49.17 68.17,42.88 v68.17,26.21 68.07,26.01 68.07,25.3 v58.32,15.54 | v39.62,9.14 43.99,13.51 v43.99,14.94
  Bottom 0.203: v68.17,26.21 68.78,25.6 99.67,25.6 113.18,12.09 JP3.7 | v39.62,9.14 39.42,9.35 37.8,9.35 36.58,8.13 J3.47 | v43.99,14.94 44.6,15.54 v58.32,15.54
D5  (via drill 0.25)
  Top 0.203: v68.89,44.5 63.91,49.48 IC1.35 63.6,50.39 63.6,50.8 67.36,50.8 67.97,50.19 67.97,48.56 69.9,46.63 69.9,35.66 70.1,35.46 70.1,23.16 v66.34,19.41 | v89.1,39.83 88.9,39.62 88.9,38.91 113.18,14.63 JP3.6 | v39.01,8.74 39.01,11.89 43.99,16.87 v43.99,18.59
  Bottom 0.203: v68.89,44.5 70.81,42.57 88.7,42.57 89.1,42.16 v89.1,39.83 | v39.01,8.74 39.01,8.13 J3.46 | v43.99,18.59 44.81,19.41 v66.34,19.41
D6  (via drill 0.25)
  Top 0.203: v97.74,32.61 113.18,17.17 JP3.5 | IC1.34 65.43,49.17 69.49,45.11 v69.49,34.04 69.39,33.83 69.39,23.27 v56.49,10.36 | v42.88,9.14 v43.99,10.26
  Bottom 0.203: v69.49,34.04 70.92,32.61 v97.74,32.61 | v42.88,9.14 42.67,9.14 41.66,8.13 J3.45 | v43.99,10.26 44.09,10.36 v56.49,10.36
D7  (via drill 0.25)
  Top 0.203: v101.5,30.38 112.78,19.1 113.18,19.1 JP3.4 | v43.89,8.74 44.6,9.45 44.6,19.51 v53.85,28.75
  Bottom 0.203: v101.5,30.38 67.56,30.38 IC1.32 66.45,29.87 65.84,29.26 54.36,29.26 v53.85,28.75 | v43.89,8.74 43.89,8.13 J3.44
ECLK  (via drill 0.25)
  Top 0.203: IC2.1 IC2.2 15.54,14.12 16.97,12.7 v16.97,8.53
  Bottom 0.203: v16.97,8.53 17.37,8.13 J3.54
GIN  (via drill 0.25)
  Top 0.203: v88.49,41.96 v91.44,41.96 | v55.37,39.62 49.48,33.73 49.48,30.79 IC1.22
  Bottom 0.203: C10.1 92.25,43.28 92.25,44.3 R13.1 | C14.1 93.88,42.88 92.76,42.88 C10.1 | v91.44,41.96 91.75,41.96 91.75,42.37 C10.1 | v88.49,41.96 86.16,39.62 v55.37,39.62
GND  (via drill 0.25)
  Top 0.203: J3.28 72.14,4.47 73.25,4.47 J3.29 74.68,4.47 75.79,4.47 J3.30 77.22,8.13 77.22,10.06 82.8,10.06 82.86,10.01 | 82.86,10.01 83.11,9.75 83.11,3.05 93.07,3.05 93.67,3.66 93.67,3.76 113.18,3.76 JP3.10 | 45.26,31.24 45.31,31.19 45.31,30.79 IC1.20 45.01,29.97 45.01,29.26 40.03,29.26 34.65,23.88 34.65,21.84 34.95,21.54 34.95,16.66 35.26,16.36 IC2.10 | 45.26,31.24 v41.66,34.85 41.55,35.05 40.74,35.87 40.74,40.64 v37.59,43.79 37.39,43.69 26.01,43.69 v26.01,42.67 | J3.1 3.56,8.13 3.56,10.87 6.4,13.72 C7.2 6.91,14.83 7.62,15.54 7.62,40.74 v7.72,40.95 7.72,57.61 7.11,58.22 PWR.K | v18.59,36.68 12.39,30.48 IC1.1 11.48,30.79 11.48,37.39 | v10.97,39.73 11.48,39.22 11.48,37.39 | 11.48,37.39 13.61,39.52 13.61,39.62 v13.72,39.73 13.82,39.93 13.82,43.48 16.76,43.48 v17.37,42.88 | v51.21,39.52 49.07,37.39 49.07,35.05 45.26,31.24 | v83.11,38.1 83.11,10.26 82.86,10.01
  Bottom 0.203: C8.2 94.39,51.92 94.39,50.29 C6.2 93.88,49.48 91.54,49.48 91.14,49.07 R14.2 | R14.2 90.63,48.16 90.63,47.14 C11.2 90.63,46.23 90.63,45.21 R13.2 90.63,44.3 90.63,43.28 C10.2 90.63,42.37 90.63,41.45 R12.2 90.63,40.54 90.63,39.52 C9.2 90.12,38.61 83.62,38.61 v83.11,38.1 | R14.2 90.12,49.07 83.41,49.07 81.38,51.1 R18.1 80.37,52.02 73.86,52.02 | 73.86,52.02 68.78,52.02 67.77,53.03 C12.2 | 73.86,52.02 73.86,48.56 73.46,48.16 64.41,48.16 61.87,45.62 IC10.16 61.37,44.5 57.81,40.95 52.63,40.95 v51.21,39.52 | C1.2 45.52,26.72 45.52,27.53 C15.2 45.52,28.35 45.52,29.67 IC1.20 | v41.66,34.85 41.45,34.85 41.05,35.26 C27.1 | v37.59,43.79 37.08,43.79 IC11.10 | C5.1 8.43,20.83 8.43,14.83 6.91,14.83 C7.2 6.1,14.02 3.86,14.02 C19.2 | C2.1 15.75,57.2 13.11,57.2 C3.1 12.09,57.61 11.18,58.52 7.42,58.52 PWR.K | v18.59,36.68 23.06,36.68 C29.1 | v10.97,39.73 8.43,39.73 C30.1 7.72,40.44 v7.72,40.95 | v13.72,39.73 13.72,39.12 IC3.11 | v17.37,42.88 17.48,42.88 17.48,43.38 IC3.7 18.09,45.31 20.22,45.31 C4.2 21.13,45.01 25.2,45.01 IC11.1 25.6,43.08 v26.01,42.67
  other vias: 1.68,61.75 79.78,61.75 42.32,61.75 1.04,39.52 1.04,14.76 80.1,11.9 78.51,51.59 78.51,40.79 79.15,34.44 79.15,19.2 41.68,27.46 44.86,40.79 48.67,40.16 53.75,41.43 21.36,33.17 8.03,26.82 13.74,17.93 38.51,23.01
  pour Bottom: 0,63.5 81.28,63.5 81.28,9.53 0,9.53
  pour Top: 0,63.5 81.28,63.5 81.28,9.53 79.38,9.53 79.38,3.81 71.12,3.81 71.12,9.53 3.17,9.53 3.17,3.81 0,3.81
GOUT
  Bottom 0.203: C22.2 116.43,40.74 122.02,35.15 127.71,35.15 J1.7
IO  (via drill 0.25)
  Top 0.203: v38.41,10.36 38.41,19.2 35.87,21.74 IC2.11
  Bottom 0.203: v38.41,10.36 39.01,9.75 43.69,9.75 45.31,8.13 J3.43
N$1
  Top 0.203: IC1.63 13.82,50.39 16.46,53.03 16.46,54.05 Q1.2
  Bottom 0.203: C2.2 17.48,56.69 17.48,55.17 16.97,55.17 Q1.2
N$2
  Top 0.203: IC1.64 11.79,50.39 11.79,54.05 Q1.1
  Bottom 0.203: C3.2 11.38,56.69 11.38,55.17 11.58,55.17 Q1.1
N$4
  Bottom 0.203: C13.2 96.62,40.74 97.84,41.96 98.45,41.96 IC9.2
N$5
  Bottom 0.203: C14.2 96.62,43.28 98.45,43.28 IC9.3
N$6
  Bottom 0.203: C16.2 96.62,45.01 98.45,45.01 IC9.4
N$7
  Bottom 0.203: R7.2 111.56,56.79 112.17,56.79 C26.1
N$8
  Bottom 0.203: R5.1 108.81,50.7 108.2,50.09 107.29,50.09 IC9.17
N$9
  Bottom 0.203: R1.1 108.81,38.91 108.81,40.74 108.51,40.74 107.29,41.96 IC9.23
N$10
  Bottom 0.203: R2.1 108.81,42.06 107.59,43.28 107.29,43.28 IC9.22
N$11
  Bottom 0.203: R3.1 108.81,44.81 107.29,44.81 IC9.21
N$12
  Bottom 0.203: R4.1 108.81,47.45 107.7,46.33 107.29,46.33 IC9.20
N$13
  Bottom 0.203: R6.1 108.81,53.85 108.81,52.02 107.9,52.02 107.29,51.41 IC9.16
N$14
  Bottom 0.203: R7.1 108.81,56.39 108.81,55.17 108.61,55.17 107.7,54.25 107.7,52.63 107.29,52.63 IC9.15
N$15
  Bottom 0.203: R4.2 111.56,47.95 112.17,47.95 C24.1 113.49,48.77 113.49,50.7 R8.1
N$16
  Bottom 0.203: R6.2 111.56,54.25 112.17,54.25 C25.1
N$17
  Bottom 0.203: R3.2 111.56,44.81 112.17,44.81 C23.1
N$18
  Bottom 0.203: R2.2 111.56,41.55 112.17,41.55 C22.1
N$19
  Bottom 0.203: R1.2 111.56,38.41 112.17,38.41 C28.1
N$20
  Bottom 0.203: C12.1 67.26,51.31 67.26,50.39 IC1.33
N$21
  Bottom 0.203: IC3.4 14.22,44.4 14.94,44.4 IC3.5
N$22  (via drill 0.25)
  Top 0.203: v16.56,39.73 v16.56,42.88
  Bottom 0.203: v16.56,39.73 16.56,39.12 IC3.9 | v16.56,42.88 16.56,43.38 IC3.6
N$23
  Bottom 0.203: R19.2 4.17,55.68 4.17,58.22 PWR.A
R//W  (via drill 0.25)
  Top 0.203: v20.02,9.14 20.02,12.19 18.09,14.12 IC2.3
  Bottom 0.203: v20.02,9.14 20.62,8.53 22.05,8.53 22.45,8.13 J3.52
RAS  (via drill 0.25)
  Top 0.203: v36.37,36.27 35.76,36.88 33.63,36.88 33.63,36.07 33.02,35.46 19.91,35.46 19.91,45.52 v19.51,45.92
  Bottom 0.203: v36.37,36.27 36.58,36.27 36.58,35.66 IC11.11 | v19.51,45.92 19.3,45.72 12.09,45.72 11.68,45.31 IC3.2
RIN  (via drill 0.25)
  Top 0.203: v55.88,36.88 54.56,35.56 54.56,34.14 51.21,30.79 IC1.23
  Bottom 0.203: C13.1 93.88,40.54 92.76,40.54 R12.1 92.25,40.54 92.25,39.52 C9.1 91.75,38.61 90.53,37.39 84.43,37.39 83.92,36.88 v55.88,36.88
ROUT
  Bottom 0.203: C28.2 116.43,37.59 121.21,32.82 127.71,32.82 J1.8
SA8  (via drill 0.25)
  Top 0.203: v40.23,32.41 36.98,35.66 35.56,35.66 v35.56,36.27
  Bottom 0.203: v40.23,32.41 47.95,32.41 48.67,33.12 IC10.27 | IC11.12 v35.56,36.27
SA9  (via drill 0.25)
  Top 0.203: v38.81,31.8 34.85,35.76 v34.85,36.17
  Bottom 0.203: v38.81,31.8 40.44,31.8 40.64,32 48.77,32 49.89,33.12 IC10.26 | v34.85,36.17 34.34,35.66 IC11.13
SA10  (via drill 0.25)
  Top 0.203: v53.95,36.58 v53.95,34.95 | v37.8,37.08 36.17,37.08 35.97,37.29 33.02,37.29 v33.02,36.27
  Bottom 0.203: v53.95,34.95 53.95,34.24 IC10.23 | v53.95,36.58 42.06,36.58 41.55,37.08 v37.8,37.08 | IC11.14 v33.02,36.27
SA11  (via drill 0.25)
  Top 0.203: v37.59,35.87 v42.06,31.39
  Bottom 0.203: v42.06,31.39 42.27,31.6 49.68,31.6 51.21,33.12 IC10.25 | v37.59,35.87 36.58,36.88 32.82,36.88 31.6,35.66 IC11.15
SA12  (via drill 0.25)
  Top 0.203: v43.79,42.16 v45.62,43.99 | v35.26,40.34 31.09,36.17 v31.09,36.07
  Bottom 0.203: v45.62,43.99 46.13,44.5 IC10.4 | v43.79,42.16 41.96,40.34 v35.26,40.34 | v31.09,36.07 30.68,35.66 IC11.16
SA13
  Bottom 0.203: IC10.28 47.35,34.24 47.35,36.17 41.86,36.17 41.35,36.68 38.2,36.68 38,36.47 37.59,36.47 36.78,37.29 31.09,37.29 29.46,35.66 IC11.17
SA14  (via drill 0.25)
  Top 0.203: v44.81,43.99 43.18,42.37 v43.18,40.74 | v30.79,39.73 28.55,37.49 v28.55,36.07
  Bottom 0.203: v44.81,43.99 44.81,44.5 IC10.3 | v43.18,40.74 42.16,39.73 v30.79,39.73 | v28.55,36.07 28.14,35.66 IC11.18
SA15  (via drill 0.25)
  Top 0.203: v43.59,35.56 41.86,37.29 v41.86,37.59
  Bottom 0.203: v43.59,35.56 43.59,34.24 IC10.31 | v41.86,37.59 41.76,37.69 28.96,37.69 26.92,35.66 IC11.19
SCIN
  Bottom 0.203: C6.1 96.11,49.38 96.11,48.36 R9.2 96.62,47.45 98.45,47.45 IC9.6
SCOUT  (via drill 0.25)
  Top 0.203: v93.37,48.87 88.9,53.34 88.9,55.88 88.59,56.19 10.36,56.19 v10.36,28.65
  Bottom 0.203: v93.37,48.87 93.88,48.36 R9.1 | v10.36,28.65 11.79,27.23 26.82,27.23 27.23,27.64 27.23,29.26 25.4,29.26 24.79,29.87 IC1.8
SYNCIN
  Bottom 0.203: R11.2 96.11,54.46 96.11,52.83 C8.1 96.62,52.43 98.45,52.43 IC9.10
VCC  (via drill 0.3)
  Top 0.61: v58.12,22.45 58.12,29.67 IC1.27 | v22.45,36.07 22.45,49.17 IC1.58 | J3.7 17.78,8.13 17.78,13.01 16.36,14.43 16.36,18.39 13.01,21.74 IC2.20 13.01,23.98 13.31,24.28 13.31,26.11 16.87,29.67 IC1.4 | v39.93,19.41 v43.38,22.86
  Bottom 0.61: 58.12,22.25 58.93,22.25 R17.1 | 58.12,22.25 56.9,22.25 R16.1 56.19,22.66 55.58,23.27 53.34,23.27 53.14,23.06 52.02,23.06 | 52.02,23.06 46.02,23.06 46.02,23.67 FB1.1 45.01,23.67 44.2,22.86 v43.38,22.86 | 58.12,22.25 v58.12,22.45 | R15.2 122.12,29.06 121.41,28.35 94.39,28.35 93.27,27.23 JP2.1 90.32,27.03 52.02,27.03 52.02,23.06 | C30.2 8.43,38.2 IC3.14 10.46,37.29 10.46,35.05 14.83,35.05 R10.1 15.65,34.04 15.75,33.93 16.05,33.93 16.87,33.12 | 16.87,33.12 16.87,30.79 IC1.4 | C4.1 21.13,47.75 22.55,49.17 IC1.58 | IC10.32 42.27,34.04 41.05,34.04 C27.2 40.23,33.53 39.83,33.12 26.21,33.12 25.6,33.73 IC11.20 25.2,35.36 23.98,35.36 C29.2 23.06,35.87 22.66,35.87 v22.45,36.07 22.25,35.87 19.61,35.87 16.87,33.12 | C19.1 3.86,11.99 6.1,11.99 C7.1 6.91,12.29 9.96,15.34 9.96,22.86 | R19.1 4.57,52.93 4.57,23.57 8.43,23.57 C5.2 9.35,22.86 9.96,22.86 | 9.96,22.86 IC2.20 13.21,21.95 15.75,19.41 v39.93,19.41
VCC/2
  Bottom 0.203: R15.1 124.87,29.97 126.29,31.39 129.84,31.39 130.66,32.21 J1.5
VCS
  Bottom 0.203: IC3.3 12.39,43.38 11.68,42.67 6.91,42.67 6.71,42.47 6.71,24.38 24.28,24.38 24.89,23.77 IC2.15
VD0
  Bottom 0.203: IC10.13 57.51,45.62 55.78,47.35 54.56,47.35 52.73,49.17 IC1.41
VD1  (via drill 0.25)
  Top 0.203: v54.76,47.95 53.24,47.95 52.43,48.77 51.21,48.77 51.21,49.17 IC1.42
  Bottom 0.203: v54.76,47.95 56.49,47.95 58.83,45.62 IC10.14
VD2  (via drill 0.25)
  Top 0.203: v56.59,43.99 52.22,48.36 49.38,48.36 49.38,49.17 IC1.43
  Bottom 0.203: v56.59,43.99 59.54,43.99 60.05,44.5 IC10.15
VD3  (via drill 0.25)
  Top 0.203: v53.24,38.3 48.26,43.28 48.26,48.56 47.65,49.17 IC1.44
  Bottom 0.203: v53.24,38.3 55.27,36.27 59.33,36.27 61.37,34.24 IC10.17
VD4  (via drill 0.25)
  Top 0.203: v70.51,35.87 70.92,36.27 70.92,48.67 v66.34,53.24
  Bottom 0.203: v70.51,35.87 67.36,32.72 60.96,32.72 60.55,33.12 IC10.18 | v66.34,53.24 63.91,50.8 46.84,50.8 46.13,50.09 IC1.45
VD5  (via drill 0.25)
  Top 0.203: v48.46,35.97 47.24,37.19 47.24,43.59 46.63,44.2 46.63,46.63 44.09,49.17 IC1.46
  Bottom 0.203: v48.46,35.97 54.36,35.97 54.46,35.87 58.83,35.87 58.83,34.24 IC10.19
VD6  (via drill 0.25)
  Top 0.203: v48.36,35.26 46.84,36.78 46.84,43.38 46.23,43.99 46.23,45.21 42.27,49.17 IC1.47
  Bottom 0.203: v48.36,35.26 48.56,35.26 48.87,35.56 54.15,35.56 54.25,35.46 57.51,35.46 57.51,34.24 IC10.20
VD7  (via drill 0.25)
  Top 0.203: v56.49,37.49 v56.49,34.75 | v41.35,38.71 41.15,38.91 41.15,48.46 40.44,49.17 IC1.48
  Bottom 0.203: v56.49,34.75 56.49,34.24 IC10.21 | v56.49,37.49 55.07,38.91 43.28,38.91 43.08,38.71 v41.35,38.71
YOUT
  Bottom 0.203: C25.2 114.91,55.17 114.5,55.58 114.5,58.12 127.1,58.12 127.71,57.51 J2.6

### Text on the board
tPlace: Pugputer 6309 - V9958 Video + OPL3 Audio v2.1 | S-VIDEO | XRGB | LEFT | RIGHT